# Altium schematic sheet CH32V305FBP6-R0.SchDoc
size 279 x 172 mm; SheetNumber: 0; SheetTotal: 0
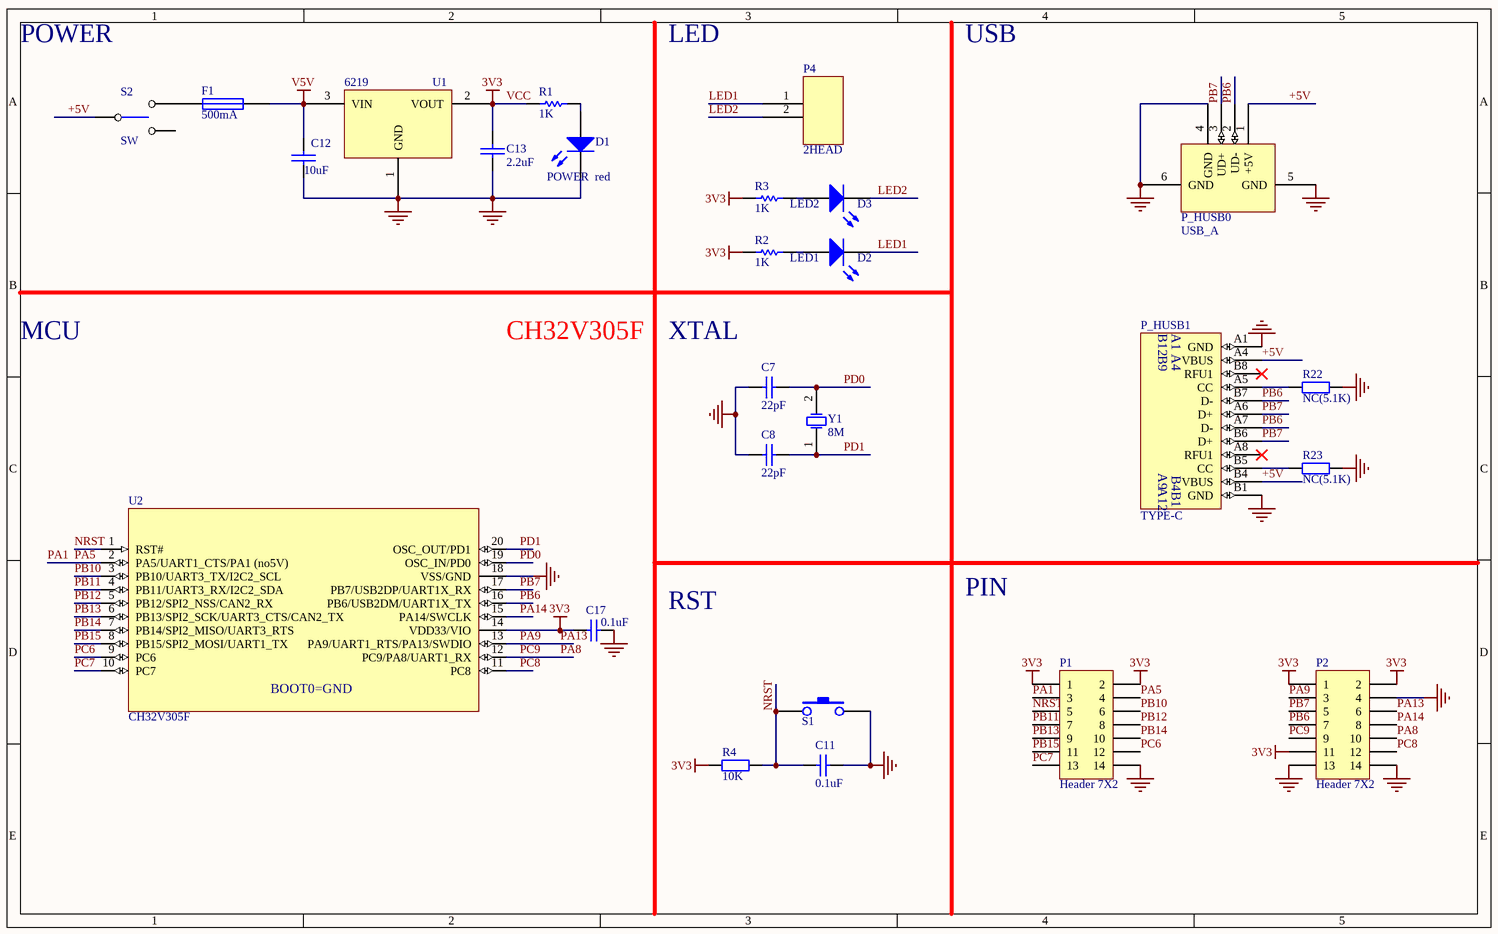
[diagram p0: CH32V305FBP6-R0.SchDoc]

## Parts
C7  22pF  [0603_C]
C8  22pF  [0603_C]
C11  0.1uF  [0603_C]
C12  10uF  [3216_C]
C13  2.2uF  [0603_C]
C17  0.1uF  [0603_C]
D1  POWER  red  [0603+]
D2  LED1  [0603+]
D3  LED2  [0603+]
F1  500mA  [0603]
P1  Header 7X2  [IDC14-2.54mm]
P2  Header 7X2  [IDC14-2.54mm]
P4  2HEAD  [SIP2-2.54mm]
P_HUSB0  USB_A  [USBAF]
P_HUSB1  TYPE-C  [TYPE-C-Receptacle-2.0]
R1  1K  [0603]
R2  1K  [0603]
R3  1K  [0603]
R4  10K  [0603]
R22  NC(5.1K)  [0603]
R23  NC(5.1K)  [0603]
S1  KEY  [SMD_6.1x3.65x2.5mm-KEY]  (value not drawn)
S2  SW  [KEY2]
U1  6219  [SOT-23]
U2  CH32V305F  [TSSOP20]
Y1  8M  [XT_AT49]

## Nets
GND: C7.1 C8.1 C11.1 C12.2 C13.2 C17.1 D1.2(K) P1.14 P2.4 P2.13 P2.14 P_HUSB0.4(GND) P_HUSB0.5(GND) P_HUSB0.6(GND) P_HUSB1.A1(GND) P_HUSB1.B1(GND) R22.2 R23.2 S1.3 U1.1(GND) U2.18(VSS/GND)
V5V: C12.1 F1.2 U1.3(VIN)
VCC: C13.1 C17.2 P1.1 P1.2 P2.1 P2.2 P2.11 R1.2 R2.1 R3.1 R4.2 U1.2(VOUT) U2.14(VDD33/VIO)  [also labelled 3V3]
+5V: P_HUSB0.1(+5V) P_HUSB1.A4(VBUS) P_HUSB1.B4(VBUS) S2.1
LED1: D2.2(K) P4.1
LED2: D3.2(K) P4.2
NRST: C11.2 P1.5 R4.1 S1.1 U2.1(RST#)
PA1: P1.3 P1.4 U2.2(PA5/UART1_CTS/PA1_(no5V))  [also labelled PA5]
PA8: P2.9 P2.10 U2.12(PC9/PA8/UART1_RX)  [also labelled PC9]
PA13: P2.3 P2.6 U2.13(PA9/UART1_RTS/PA13/SWDIO)  [also labelled PA9]
PA14: P2.8 U2.15(PA14/SWCLK)
PB6: P2.7 P_HUSB0.2(UD-) P_HUSB1.A7(D-) P_HUSB1.B7(D-) U2.16(PB6/USB2DM/UART1X_TX)
PB7: P2.5 P_HUSB0.3(UD+) P_HUSB1.A6(D+) P_HUSB1.B6(D+) U2.17(PB7/USB2DP/UART1X_RX)
PB10: P1.6 U2.3(PB10/UART3_TX/I2C2_SCL)
PB11: P1.7 U2.4(PB11/UART3_RX/I2C2_SDA)
PB12: P1.8 U2.5(PB12/SPI2_NSS/CAN2_RX)
PB13: P1.9 U2.6(PB13/SPI2_SCK/UART3_CTS/CAN2_TX)
PB14: P1.10 U2.7(PB14/SPI2_MISO/UART3_RTS)
PB15: P1.11 U2.8(PB15/SPI2_MOSI/UART1_TX)
PC6: P1.12 U2.9(PC6)
PC7: P1.13 U2.10(PC7)
PC8: P2.12 U2.11(PC8)
PD0: C7.2 U2.19(OSC_IN/PD0) Y1.2(OSC2)
PD1: C8.2 U2.20(OSC_OUT/PD1) Y1.1(OSC1)
NetD1_1: D1.1(A) R1.1
NetD2_1: D2.1(A) R2.2
NetD3_1: D3.1(A) R3.2
NetF1_1: F1.1 S2.3
NetP_HUSB1_A5: P_HUSB1.A5(CC) R22.1
NetP_HUSB1_B5: P_HUSB1.B5(CC) R23.1

Not connected (* = marked no-connect by the designer): P_HUSB1 A8(RFU1)* B8(RFU1)*; S2 2

## Notes on the sheet
- POWER
- LED
- USB
- MCU
- CH32V305F
- XTAL
- RST
- PIN
- Title
- Size:
- Date:
- A3
- Number:
- Time:
- Revision:
- Sheet
- of
- File:
- (in symbol CH32V305F) BOOT0=GND
- (in symbol TYPE-C1) B12; B9; A9; A12

## Library data of the parts
C7 C8 C11 = Cap: Capacitor; Published: 8-Jun-2000; LatestRevisionDate: 17-Jul-2002; LatestRevisionNote: Re-released for DXP Platform.; PackageReference: RAD-0.3; Publisher: Altium Limited
  C11: Value: 0.1uF
C12 C13 = CAP: Capacitor
C17 = Cap: Capacitor; Value: 15pF; Published: 8-Jun-2000; LatestRevisionDate: 17-Jul-2002; LatestRevisionNote: Re-released for DXP Platform.; PackageReference: RAD-0.3; Publisher: Altium Limited
D1-D3 = LED0: Typical INFRARED GaAs LED; Published: 8-Jun-2000; LatestRevisionDate: 08-Jul-2005; LatestRevisionNote: Mech Layer 1 removed.; PackageReference: LED-0; Publisher: Altium Limited
F1 = FUSE1: Fuse
P1 P2 = Header 7X2: Header, 7-Pin, Dual row; LatestRevisionDate: 17-Jul-2002; LatestRevisionNote: Re-released for DXP Platform.; Publisher: Altium Limited
P_HUSB0 = USB: USB Port
P_HUSB1 = TYPE-C1
R1-R3 = Res Semi: Semiconductor Resistor; Published: 8-Jun-2000; LatestRevisionDate: 17-Jul-2002; LatestRevisionNote: Re-released for DXP Platform.; PackageReference: AXIAL-0.5; Publisher: Altium Limited; Value: 1K
R4 R22 R23 = Res2: Resistor
  R4: Published: 8-Jun-2000; LatestRevisionDate: 17-Jul-2002; LatestRevisionNote: Re-released for DXP Platform.; PackageReference: AXIAL-0.4; Publisher: Altium Limited; Value: 10K
U1 = LM1117_3.3V
U2 = CH32V305F: RISC-V FPU HD-MCU, 144MHz, USB_480M, CAN, UART*2, SPI
Y1 = XTAL: Crystal Oscillator; Published: 8-Jun-2000; LatestRevisionDate: 17-Jul-2002; LatestRevisionNote: Re-released for DXP Platform.; PackageReference: R38; Publisher: Altium Limited